# Altium schematic sheet Peripherals.SchDoc
size A; SheetNumber: 2; SheetTotal: 2
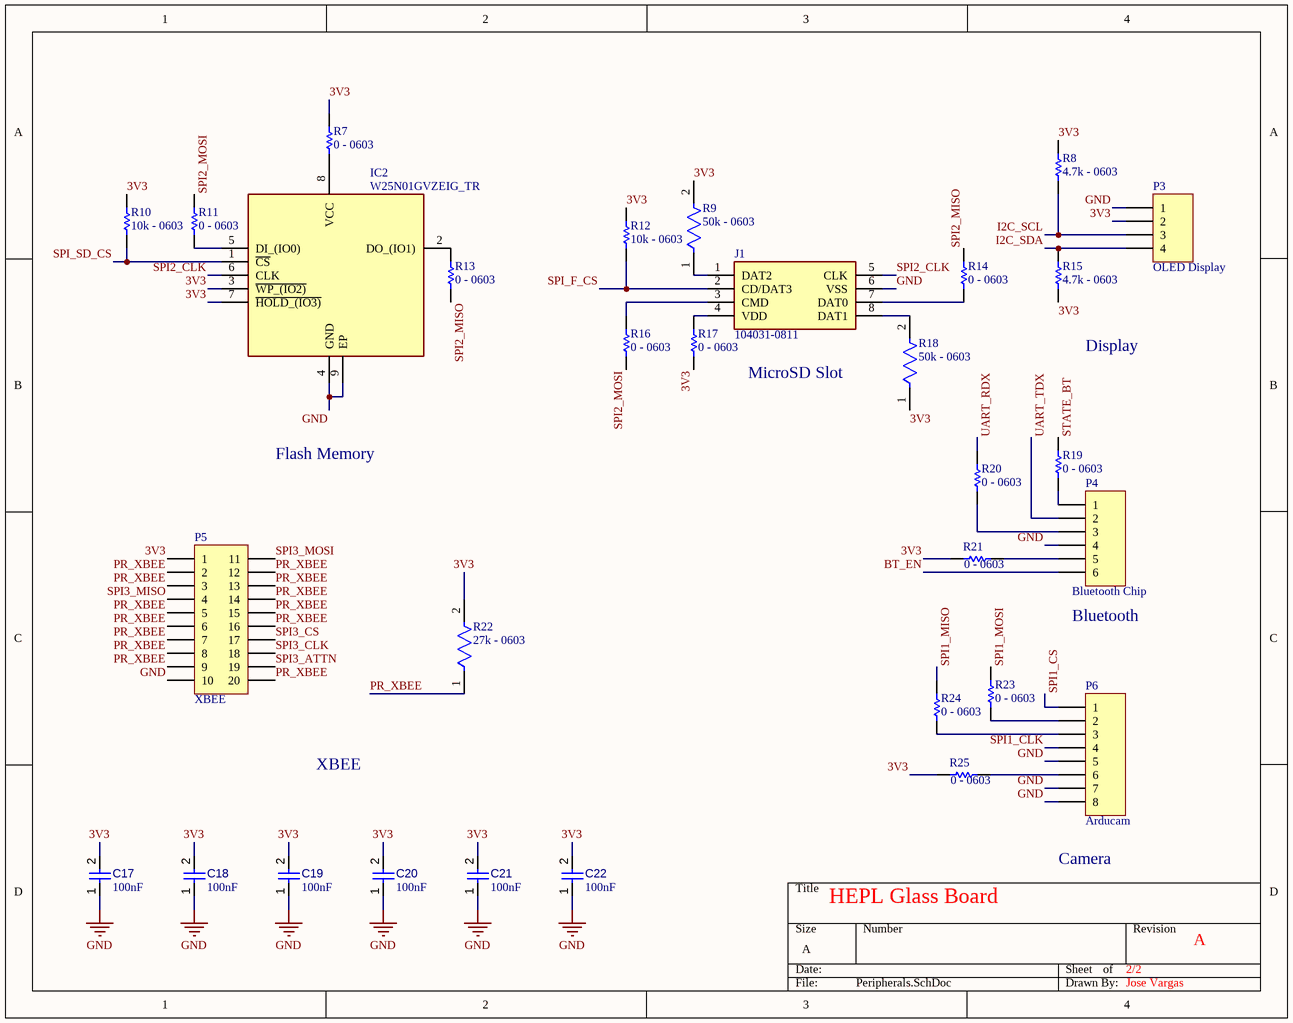
[diagram p0: Peripherals.SchDoc]

## Parts
C17  value 100nF  [CAPC1608X90X40NL10T20]  (hidden comment: Capacitor 100 nF +/-10% 50 V 0603)
C18  value 100nF  [CAPC1608X90X40NL10T20]  (hidden comment: Capacitor 100 nF +/-10% 50 V 0603)
C19  value 100nF  [CAPC1608X90X40NL10T20]  (hidden comment: Capacitor 100 nF +/-10% 50 V 0603)
C20  value 100nF  [CAPC1608X90X40NL10T20]  (hidden comment: Capacitor 100 nF +/-10% 50 V 0603)
C21  value 100nF  [CAPC1608X90X40NL10T20]  (hidden comment: Capacitor 100 nF +/-10% 50 V 0603)
C22  value 100nF  [CAPC1608X90X40NL10T20]  (hidden comment: Capacitor 100 nF +/-10% 50 V 0603)
IC2  W25N01GVZEIG_TR  [SON127P800X600X80-9N-D]
J1  104031-0811  [1040310811]
P3  OLED Display  [HDR1X4]
P4  Bluetooth Chip  [HDR1X6]
P5  XBEE  [HDR2X10_CEN]
P6  Arducam  [HDR1X8]
R7  0 - 0603  [RESC1608X55X25ML10T15]
R8  4.7k - 0603  [RESC1608X55X30NL15T15]
R9  50k - 0603  [FP-TNPU0603-e3-MFG]
R10  10k - 0603  [RESC1609X55X30LL15T15]
R11  0 - 0603  [RESC1608X55X25ML10T15]
R12  10k - 0603  [RESC1609X55X30LL15T15]
R13  0 - 0603  [RESC1608X55X25ML10T15]
R14  0 - 0603  [RESC1608X55X25ML10T15]
R15  4.7k - 0603  [RESC1608X55X30NL15T15]
R16  0 - 0603  [RESC1608X55X25ML10T15]
R17  0 - 0603  [RESC1608X55X25ML10T15]
R18  50k - 0603  [FP-TNPU0603-e3-MFG]
R19  0 - 0603  [RESC1608X55X25ML10T15]
R20  0 - 0603  [RESC1608X55X25ML10T15]
R21  0 - 0603  [RESC1608X55X25ML10T15]
R22  27k - 0603  [FP-CRCW0603-e3-IPC_A]
R23  0 - 0603  [RESC1608X55X25ML10T15]
R24  0 - 0603  [RESC1608X55X25ML10T15]
R25  0 - 0603  [RESC1608X55X25ML10T15]

## Nets
GND: C17.1 C18.1 C19.1 C20.1 C21.1 C22.1 IC2.4(GND) IC2.9(EP) J1.6(VSS) P3.1 P4.4 P5.10 P6.5 P6.7 P6.8
3V3: C17.2 C18.2 C19.2 C20.2 C21.2 C22.2 IC2.3(~{WP_(IO2)}) IC2.7(~{HOLD_(IO3)}) P3.2 P5.1 R7.1 R8.2 R9.2 R10.2 R12.2 R15.1 R17.2 R18.1 R21.1 R22.2 R25.1
BT_EN: P4.6
I2C_SCL: P3.3 R8.1
I2C_SDA: P3.4 R15.2
PR_XBEE: P5.2 P5.3 P5.5 P5.6 P5.7 P5.8 P5.9 P5.12 P5.13 P5.14 P5.15 P5.16 P5.20 R22.1
SPI1_CLK: P6.4
SPI1_CS: P6.1
SPI1_MISO: R24.2
SPI1_MOSI: R23.1
SPI2_CLK: IC2.6(CLK) J1.5(CLK)
SPI2_MISO: R13.2 R14.2
SPI2_MOSI: R11.1 R16.2
SPI3_ATTN: P5.19
SPI3_CLK: P5.18
SPI3_CS: P5.17
SPI3_MISO: P5.4
SPI3_MOSI: P5.11
SPI_F_CS: J1.2(CD/DAT3) R12.1
SPI_SD_CS: IC2.1(~{CS}) R10.1
STATE_BT: R19.1
UART_RDX: R20.1
UART_TDX: P4.2
NetIC2_2: IC2.2(DO_(IO1)) R13.1
NetIC2_5: IC2.5(DI_(IO0)) R11.2
NetIC2_8: IC2.8(VCC) R7.2
NetJ1_1: J1.1(DAT2) R9.1
NetJ1_3: J1.3(CMD) R16.1
NetJ1_4: J1.4(VDD) R17.1
NetJ1_7: J1.7(DAT0) R14.1
NetJ1_8: J1.8(DAT1) R18.2
NetP4_1: P4.1 R19.2
NetP4_3: P4.3 R20.2
NetP4_5: P4.5 R21.2
NetP6_2: P6.2 R23.2
NetP6_3: P6.3 R24.1
NetP6_6: P6.6 R25.2

## Notes on the sheet
- Display
- MicroSD Slot
- Flash Memory
- (near P4) Bluetooth
- XBEE
- HEPL Glass Board
- (near P6) Camera
- 2/2
- A
- Jose Vargas

## Library data of the parts
C17-C22 = CMP-001-00017-6: Chip Capacitor, 100 nF, +/- 10%, 50 V, 0603 (1608 Metric); Voltage Rating: 50V; Capacitor Type: Ceramic; Tolerance: 10%; Mounting Technology: SM; Max Operating Temperature: 125°C; RoHS Compliant: True; Pins: 2; Case/Package: 0603; Min Operating Temperature: -55°C
IC2 = W25N01GVZEIG_TR: Integrated Circuit; Manufacturer_Name: Winbond; Manufacturer_Part_Number: W25N01GVZEIG TR; Datasheet Link: https://www.winbond.com/resource-files/w25n01gv revg 032116.pdf; Height: 0.8mm; Mouser Part Number: 454-W25N01GVZEIGTR; Mouser Price/Stock: https://www.mouser.co.uk/ProductDetail/Winbond/W25N01GVZEIG-TR?qs=qSfuJ%252Bfl%2Fd6niBi0Qz1MPg%3D%3D; Arrow Part Number: W25N01GVZEIG TR; Arrow Price/Stock: https://www.arrow.com/en/products/w25n01gvzeigtr/winbond-electronics?region=nac
J1 = 104031-0811: Connector; Manufacturer_Name: Molex; Datasheet Link: http://www.molex.com/webdocs/datasheets/pdf/en-us/1040310811_MEMORY_CARD_SOCKET.pdf; Manufacturer_Part_Number: 104031-0811; Mouser Part Number: 538-104031-0811; Mouser Price/Stock: https://www.mouser.co.uk/ProductDetail/Molex/104031-0811?qs=udsGRKD4nA3Tvy7wqky%252BuA%3D%3D
P3 = Header 4: Header, 4-Pin; LatestRevisionDate: 17-Jul-2002; LatestRevisionNote: Re-released for DXP Platform.; Publisher: Altium Limited
P4 = Header 6: Header, 6-Pin; LatestRevisionDate: 17-Jul-2002; LatestRevisionNote: Re-released for DXP Platform.; Publisher: Altium Limited
P5 = Header 10X2A: Header, 10-Pin, Dual row; LatestRevisionDate: 17-Jul-2002; LatestRevisionNote: Re-released for DXP Platform.; Publisher: Altium Limited
P6 = Header 8: Header, 8-Pin; LatestRevisionDate: 17-Jul-2002; LatestRevisionNote: Re-released for DXP Platform.; Publisher: Altium Limited
R7 R11 R13 R14 R16 R17 R19-R21 R23-R25 = CMP-2100-03667-1: Chip Resistor, 0 Ohm, +/- 5%, 0.1 W, -55 to 155 degC, 0603 (1608 Metric), RoHS, Tape and Reel; Manufacturer: Yageo; Temperature Coefficient: 200ppm/degreesC; Voltage Rating: 50V; Power Rating: 100mW; Resistance: 0mOhm; Width: 0.8mm; Max Operating Temperature: 155degC; Tolerance: 5%; Package Reference: 0603; Height: 0.45mm; Depth: 0.8mm; Package Description: 2-Pin Surface Mount Device, Body 1.6 x 0.8 mm; Termination: SMD/SMT; Package Quantity: 5000; Case/Package: 0603; Case Code (Imperial): 0603; Radiation Hardening: No; Number of Pins: 2; Length: 1.6mm; Lead Free: LeadFree; Voltage Rating (DC): 50V; Military Standard: Not; Datasheet URL: http://www.yageo.com/NewPortal/yageodocoutput?fileName=/pdf/R-Chip/PYu-RC_Group_51_RoHS_L_5.pdf; Manufacturer URL: http://www.yageo.com/; Packaging: TapeandReel; Case Code (Metric): 1608; Min Operating Temperature: -55degC; Composition: ThickFilm; RoHSCompliant: true; Contact Plating: Tin; Datasheet Version: Rev. 5, 10/2016; REACH SVHC: NoSVHC
R8 R15 = CMP-1012-00586-3: Precision Thick Film Chip Resistor, 4.7 KOhm, +/- 1%, -55 to 155 degC, 0603 (1608 Metric), RoHS, Tape and Reel; Resistance: 220 Ohm; Voltage Rating: 50 V; Elements: 4; Case\Package: 1205; Tolerance: 5%; Power Rating: 250 mW; PackageReference: 0603; Max Operating Temperature: 125 degC; REACH SVHC: No SVHC; Width: 0.063 inch; Length: 0.126 inch; Height: 0.024 inch; Mount: Surface Mount; Package Quantity: 1; DatasheetVersion: Apr-15; ComponentLink1Description: Manufacturer URL; Min Operating Temperature: -55 degC; Packaging: Tape and Reel; Radiation Hardening: No; ComponentLink2URL: http://industrial.panasonic.com/cdbs/www-data/pdf/RDA0000/AOA0000C86.pdf; Case Code (Metric): 3216; Pins: 8; Case Code (Imperial): 1206; Type (Resistor): Thick Film; RoHSCompliant: true; ComponentLink2Description: Datasheet; PackageDescription: 2-Pin Surface Mount Device, Body 1.6 x 0.85 mm; ComponentLink1URL: http://www.panasonic.com/
R9 R18 = CMP-02407-013067-1: RES SMD 50K OHM 0.02% 1/10W 0603; Temperature Coefficient: 5ppm/°C; Max Power Dissipation: 100mW; Resistance: 50kR; Max Operating Temperature: 125°C; Min Operating Temperature: -55°C; Case Code (Metric): 1608; Features: Moisture Resistant; Resistor Type: Thin Film; Packaging: Cut Tape; Case/Package: 0603; Tolerance: 0.02%; Number of Terminations: 2; Case Code (Imperial): 0603
R10 R12 = CMP-1012-00623-3: Chip Resistor, 10 KOhm, +/- 1%, 0.1 W, -55 to 155 degC, 0603 (1608 Metric), RoHS, Tape and Reel; Manufacturer: Panasonic; Voltage Rating: 75V; Case\/Package: 0603; Power Rating: 100mW; Resistance: 10KOhm; Temperature Coefficient: 100ppm\/degreesC; Number of Pins: 2; Package Reference: 603; Depth: 0.8mm; Mount: SurfaceMount; Package Description: 2-Pin Surface Mount Device, Body 1.6 x 0.85 mm; Datasheet Version: 02/2017; Length: 1.6mm; Lead Free: LeadFree; Height: 0.45mm; Number of Terminations: 2; Max Power Dissipation: 100mW; Min Operating Temperature: -55degC; Datasheet URL: https://industrial.panasonic.com/cdbs/www-data/pdf/RDA0000/AOA0000C304.pdf; Termination: SMD/SMT; Case Code (Metric): 1608; Case Code (Imperial): 0603; Tolerance: 1%; Max Operating Temperature: 155degC; RoHSCompliant: true; Voltage Rating (DC): 75V; Radiation Hardening: No; Packaging: TapeandReel; Composition: ThickFilm; Mounting Technology: SurfaceMount; Manufacturer URL: http://www.panasonic.com/; Width: 0.031inch; REACH SVHC: NoSVHC; Contact Plating: Tin; Military Standard: Not; Package Quantity: 1
R22 = CMP-1012-00670-3: RES Thick Film, 27kΩ, 1%, 0.1W, 100ppm/°C, 0603; Resistance: 27kR; Voltage Rating (DC): 75V; Power Rating: 100mW; Military Standard: Not; Termination: SMD/SMT; Tolerance: 1%; Min Operating Temperature: -55°C; Package Quantity: 10; Width: 0.85mm; Radiation Hardening: No; Length: 1.55mm; Case/Package: 0603; Number of Terminations: 2; Contact Plating: Tin; Number of Pins: 2; Composition: Thick Film; Depth: 0.85mm; Mount: Surface Mount; Max Operating Temperature: 155°C; Weight: 7.1E-05oz; Voltage Rating: 75V; Packaging: Tape and Reel; Case Code (Imperial): 0603; Temperature Coefficient: 100ppm/°C; Height: 0.45mm; Lead Free: Lead Free; Case Code (Metric): 1608; Max Power Dissipation: 100mW; Features: Automotive AEC-Q200